# Altium schematic sheet mcu.SchDoc
size A4; DocumentNumber: 3; SheetNumber: 3; SheetTotal: 5
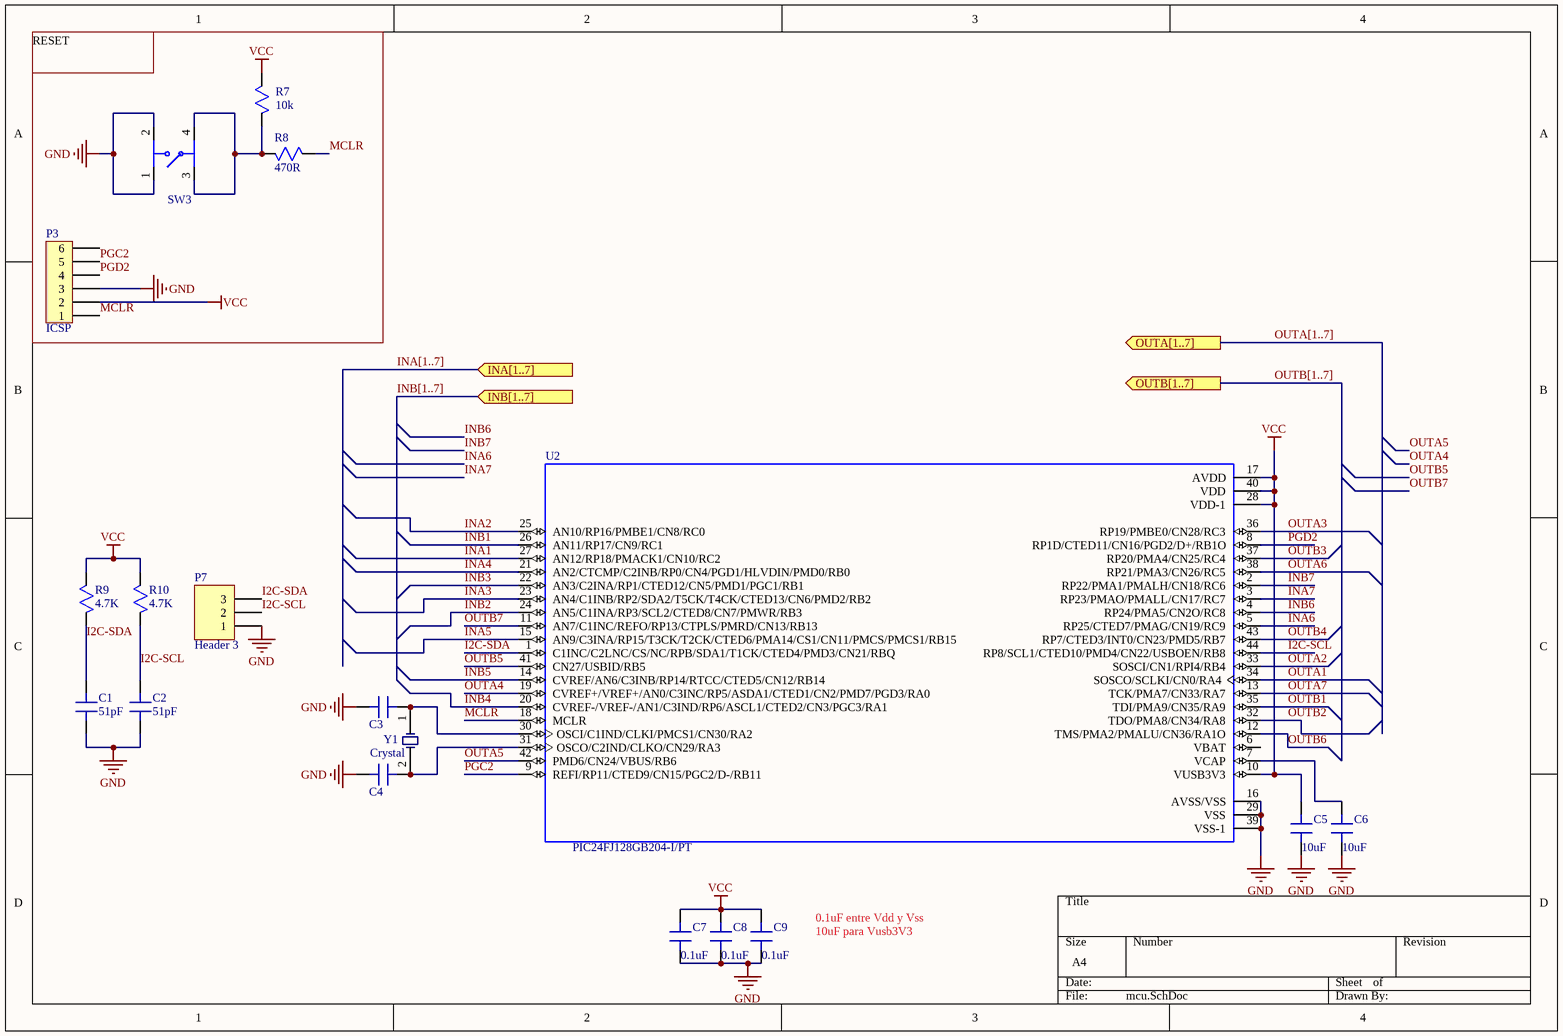
[diagram p0: mcu.SchDoc]

## Parts
C1  51pF  [Capacitor0805]
C2  51pF  [Capacitor0805]
C3  6pF  [Capacitor0805]  (value not drawn)
C4  6pF  [Capacitor0805]  (value not drawn)
C5  10uF  [Capacitor0805]
C6  10uF  [Capacitor0805]
C7  0.1uF  [Capacitor0805]
C8  0.1uF  [Capacitor0805]
C9  0.1uF  [Capacitor0805]
P3  ICSP  [MALE6PIN]
P7  Header 3  [HDR1X3]
R7  10k  [ResistorSMD0805]
R8  470R  [ResistorSMD0805]
R9  4.7K  [ResistorSMD0805]
R10  4.7K  [ResistorSMD0805]
SW3  Tactile Switch  [TactileSwitch]  (value not drawn)
U2  PIC24FJ128GB204-I/PT  [QFP80P1200X1200X120-44N]
Y1  Crystal  [CRYSTALSMDMini]

## Ports
INA[1..7] (in), INB[1..7] (in), OUTA[1..7] (out), OUTB[1..7] (out)

## Nets
GND: C1.2 C2.2 C3.1 C4.1 C5.1 C6.1 C7.1 C8.1 C9.1 P3.3 P7.1 SW3.1 SW3.2 U2.16(AVSS/VSS) U2.29(VSS) U2.39(VSS-1)
VCC: C5.2 C7.2 C8.2 C9.2 P3.2 R7.2 R9.2 R10.2 U2.10(VUSB3V3) U2.17(AVDD) U2.28(VDD-1) U2.40(VDD)
I2C-SCL: C2.1 P7.2 R10.1 U2.44(RP8/SCL1/CTED10/PMD4/CN22/USBOEN/RB8)
I2C-SDA: C1.1 P7.3 R9.1 U2.1(C1INC/C2LNC/CS/NC/RPB/SDA1/T1CK/CTED4/PMD3/CN21/RBQ)
INA1: U2.27(AN12/RP18/PMACK1/CN10/RC2)
INA2: U2.25(AN10/RP16/PMBE1/CN8/RC0)
INA3: U2.23(AN4/C1INB/RP2/SDA2/T5CK/T4CK/CTED13/CN6/PMD2/RB2)
INA4: U2.21(AN2/CTCMP/C2INB/RP0/CN4/PGD1/HLVDIN/PMD0/RB0)
INA5: U2.15(AN9/C3INA/RP15/T3CK/T2CK/CTED6/PMA14/CS1/CN11/PMCS/PMCS1/RB15)
INA6: U2.5(RP25/CTED7/PMAG/CN19/RC9)
INA7: U2.3(RP23/PMAO/PMALL/CN17/RC7)
INB1: U2.26(AN11/RP17/CN9/RC1)
INB2: U2.24(AN5/C1INA/RP3/SCL2/CTED8/CN7/PMWR/RB3)
INB3: U2.22(AN3/C2INA/RP1/CTED12/CN5/PMD1/PGC1/RB1)
INB4: U2.20(CVREF-/VREF-/AN1/C3IND/RP6/ASCL1/CTED2/CN3/PGC3/RA1)
INB5: U2.14(CVREF/AN6/C3INB/RP14/RTCC/CTED5/CN12/RB14)
INB6: U2.4(RP24/PMA5/CN2O/RC8)
INB7: U2.2(RP22/PMA1/PMALH/CN18/RC6)
MCLR: P3.1 R8.2 U2.18(MCLR)
OUTA1: U2.34(SOSCO/SCLKI/CN0/RA4)
OUTA2: U2.33(SOSCI/CN1/RPI4/RB4)
OUTA3: U2.36(RP19/PMBE0/CN28/RC3)
OUTA4: U2.19(CVREF+/VREF+/AN0/C3INC/RP5/ASDA1/CTED1/CN2/PMD7/PGD3/RA0)
OUTA5: U2.42(PMD6/CN24/VBUS/RB6)
OUTA6: U2.38(RP21/PMA3/CN26/RC5)
OUTA7: U2.13(TCK/PMA7/CN33/RA7)
OUTB1: U2.35(TDI/PMA9/CN35/RA9)
OUTB2: U2.32(TDO/PMA8/CN34/RA8)
OUTB3: U2.37(RP20/PMA4/CN25/RC4)
OUTB4: U2.43(RP7/CTED3/INT0/CN23/PMD5/RB7)
OUTB5: U2.41(CN27/USBID/RB5)
OUTB6: U2.12(TMS/PMA2/PMALU/CN36/RA1O)
OUTB7: U2.11(AN7/C1INC/REFO/RP13/CTPLS/PMRD/CN13/RB13)
PGC2: P3.5 U2.9(REFI/RP11/CTED9/CN15/PGC2/D-/RB11)
PGD2: P3.4 U2.8(RP1D/CTED11/CN16/PGD2/D+/RB1O)
NetC3_2: C3.2 U2.30(OSCI/C1IND/CLKI/PMCS1/CN30/RA2) Y1.1
NetC4_2: C4.2 U2.31(OSCO/C2IND/CLKO/CN29/RA3) Y1.2
NetC6_2: C6.2 U2.7(VCAP)
NetR7_1: R7.1 R8.1 SW3.3 SW3.4

Not connected (* = marked no-connect by the designer): P3 6; U2 6(VBAT)

## Buses and harness runs
bus INA[1..7] = port INA[1..7]
bus INB[1..7] = port INB[1..7]
bus OUTA[1..7] = port OUTA[1..7]
bus OUTB[1..7] = port OUTB[1..7]

## Notes on the sheet
- RESET
- 0.1uF entre Vdd y Vss
  10uF para Vusb3V3

## Library data of the parts
C1 C2 = CapacitorSMD: Ceramic Capacitor; Manufacturer Name: Yageo; Manufacturers Part Number: CC0805JRNPO0BN510; PartDescription: CAP CER 51PF 50V C0G/NP0 0805; Type: SMD; Digi-Key Part Number: 311-4223-1-ND; Value: 51pF; Package: 0805
C3 C4 = CapacitorSMD: Ceramic Capacitor; Manufacturer Name: Yageo; Manufacturers Part Number: CC0805CRNPO9BN6R0; PartDescription: CAP CER 6PF 50V NP0 0805; Type: SMD; Digi-Key Part Number: 311-4149-1-ND; Value: 6pF; Package: 0805
C5 C6 = CapacitorSMD: Ceramic Capacitor; Manufacturer Name: Yageo; Manufacturers Part Number: CC0805ZKY5V6BB106; PartDescription: CAP CER 10UF 10V Y5V 0805; Type: SMD; Value: 10uF; Digi-Key Part Number: 311-1355-1-ND; Package: 0805
C7-C9 = CapacitorSMD: Ceramic Capacitor; Manufacturer Name: Yageo; Manufacturers Part Number: CC0805KRX7R8BB104; PartDescription: CAP CER 0.1UF 25V X7R 0805; Type: SMD; Value: 0.1uF; Digi-Key Part Number: 311-1141-1-ND
  C7: package: 0805
  C8 C9: Package: 0805
P3 = PHM1x6P2.54: Pin Header Male 6 Pins Pitch 2.54mm; Manufacturer Name: Harwin Inc.; Manufacturers Part Number: M20-9990645; PartDescription: CONN HEADER VERT 6POS 2.54MM; Digi-Key Part Number: 952-2269-ND; Package: 6POS; Type: Thru-hole
P7 = Header 3: Header, 3-Pin
R7 = ResistorSMD: Chip Resistor SMD; Manufacturer Name: Yageo; Manufacturers Part Number: RC0805JR-0710KL; PartDescription: RES SMD 10K OHM 5% 1/8W 0805; Digi-Key Part Number: 311-10KARCT-ND; Value: 10k; Package: 0805; Type: SMD
R8 = ResistorSMD: Chip Resistor SMD; Manufacturer Name: Yageo; Manufacturers Part Number: RC0805FR-07470RL; PartDescription: RES SMD 470 OHM 1% 1/8W 0805; Digi-Key Part Number: 311-470CRCT-ND; Value: 470R; Package: 0805; Type: SMD
R9 R10 = ResistorSMD: Chip Resistor SMD; Manufacturer Name: Yageo; Manufacturers Part Number: RC0805FR-074K7L; PartDescription: RES SMD 4.7K OHM 1% 1/8W 0805; Digi-Key Part Number: 311-4.70KCRCT-ND; Value: 4.7K; Package: 0805; Type: SMD
SW3 = Tactile Switch: Switch Contact; Manufacturer Name: C&K; Manufacturers Part Number: PTS645SM43SMTR92 LFS; PartDescription: SWITCH TACTILE SPST-NO 0.05A 12V; Digi-Key Part Number: CKN9112CT-ND; Package: 6.00mm x 6.00mm; Type: SMD
U2 = PIC24FJ128GB204-I/PT: 128KB Flash, 8KB RAM, 16 MIPS, USB OTG, Crypto, 44 TQFP 10x10x1mm TRAY; Manufacturer Name: Microchip; PartDescription: IC MCU 16BIT 128KB FLASH 44TQFP; Package: 44-TQFP; Digi-Key Part Number: PIC24FJ128GB204-I/PT-ND; Manufacturers Part Number: PIC24FJ128GB204-I/PT; Type: SMD
Y1 = Crystal: Crystal SMD; Manufacturer Name: ECS Inc.; Manufacturers Part Number: ECS-240-8-30B-CKM; PartDescription: CRYSTAL 24.0000MHZ 8PF SMD; Value: 24MHz; Digi-Key Part Number: XC1842CT-ND; Package: 4-SMD, No Lead; Type: SMD